# EAGLE design DRUM_1_CONTROL_8 (EAGLE 9.6.2)
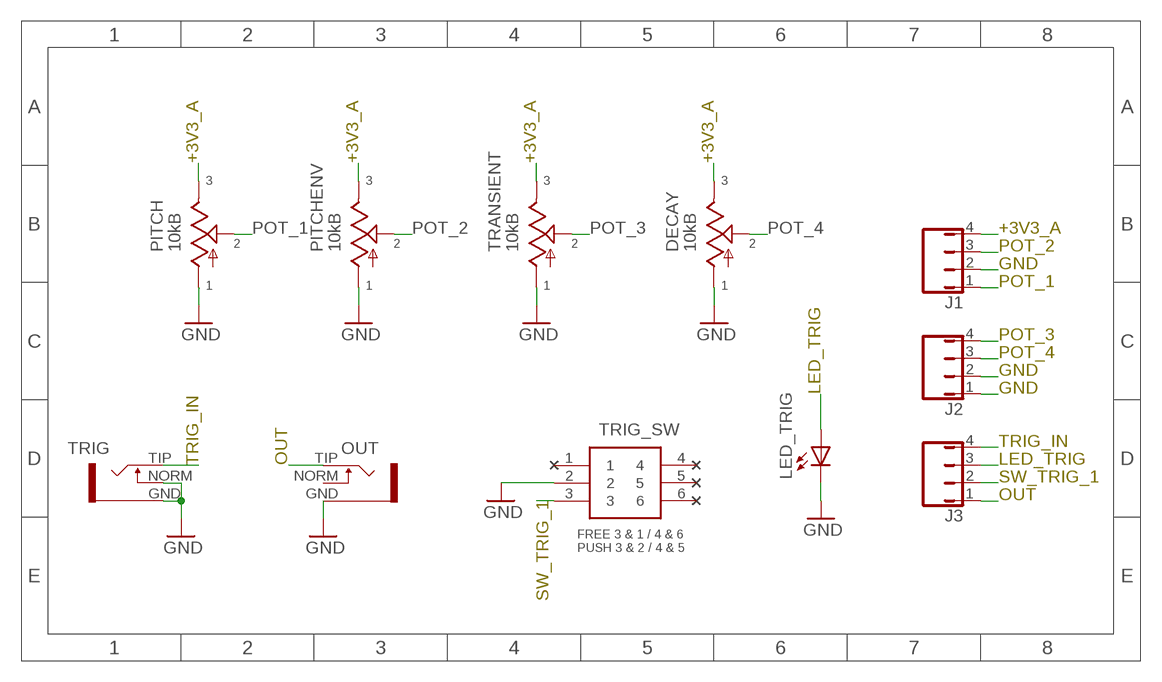
[diagram p0: schematic, sheet 1]

## Parts
DECAY  10kB  9MM_SNAP-IN_POT_  [9MM_SNAP-IN_POT]
J1  1x4 FEMALE HEADER  JMP/4P/SIP  [JMP/4P/SIP]
J2  1x4 FEMALE HEADER  JMP/4P/SIP  [JMP/4P/SIP]
J3  1x4 FEMALE HEADER  JMP/4P/SIP  [JMP/4P/SIP]
LED_TRIG  LEDS3MM  [LED3MM]
OUT  THONKICONN  [INSTRUO_S_JACK_SMALL2]
PITCH  10kB  9MM_SNAP-IN_POT_  [9MM_SNAP-IN_POT]
PITCHENV  10kB  9MM_SNAP-IN_POT_  [9MM_SNAP-IN_POT]
TRANSIENT  10kB  9MM_SNAP-IN_POT_  [9MM_SNAP-IN_POT]
TRIG  THONKICONN  [INSTRUO_S_JACK_SMALL2]
TRIG_SW  GPBS-800L 8MM MOMENTARY  GPBS-800L  [GPBS800L]

## Nets
+3V3_A [+3V3]: DECAY.3(E) J1.4 PITCH.3(E) PITCHENV.3(E) TRANSIENT.3(E)
GND [GND]: DECAY.1(A) J1.2 J2.1 J2.2 LED_TRIG.K(C) OUT.GND PITCH.1(A) PITCHENV.1(A) TRANSIENT.1(A) TRIG.GND TRIG.NORM TRIG_SW.2
LED_TRIG: J3.3 LED_TRIG.A
OUT: J3.1 OUT.TIP
POT_1: J1.1 PITCH.2(S)
POT_2: J1.3 PITCHENV.2(S)
POT_3: J2.4 TRANSIENT.2(S)
POT_4: DECAY.2(S) J2.3
SW_TRIG_1: J3.2 TRIG_SW.3
TRIG_IN: J3.4 TRIG.TIP
Unconnected: OUT.NORM TRIG_SW.1 TRIG_SW.4 TRIG_SW.5 TRIG_SW.6

## Notes on the sheet
- FREE 3 & 1 / 4 & 6
  PUSH 3 & 2 / 4 & 5

## Library data of the parts
DECAY PITCH PITCHENV TRANSIENT = AA_Stobbert_1:9MM_SNAP-IN_POT: POTENTIOMETER
J1-J3 = AA_Stobbert_1:JMP/4P/SIP
LED_TRIG = AA_Stobbert_1:LEDS
OUT TRIG = AA_Stobbert_1:THONKICONN: PJ301M-12
TRIG_SW = SamacSys_Parts:GPBS-800L: Pushbutton Switches DPDT Latching ON-ON Source: Datasheet <http://switches-connectors-custom.cwind.com/Asset/GPBS800LR1.pdf>; DESCRIPTION: Pushbutton Switches DPDT Latching ON-ON; HEIGHT: 13mm; MANUFACTURER_NAME: CW Industries; MANUFACTURER_PART_NUMBER: GPBS-800L; MOUSER_PART_NUMBER: 629-GPBS-800L; MOUSER_PRICE-STOCK: https://www.mouser.co.uk/ProductDetail/CW-Industries/GPBS-800L?qs=sajaCoHCXPRO4feefwykvw%3D%3D

## Net classes
0 default: width 0.254 mm
1 +3V3: width 0.305 mm
2 GND: width 0.254 mm

## Board
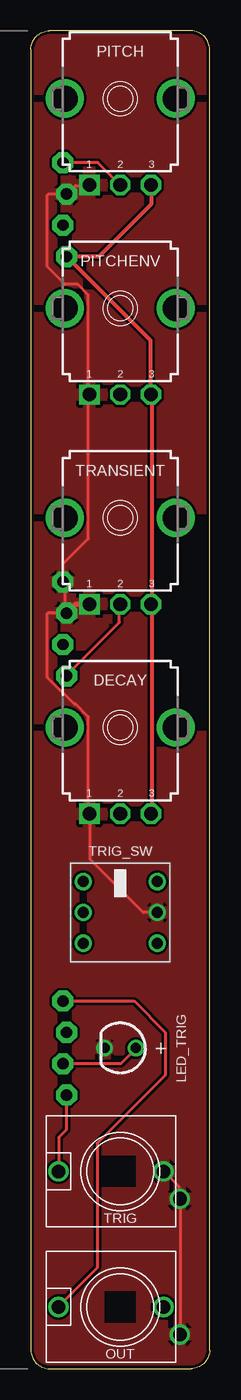
[diagram p1: board, top side]
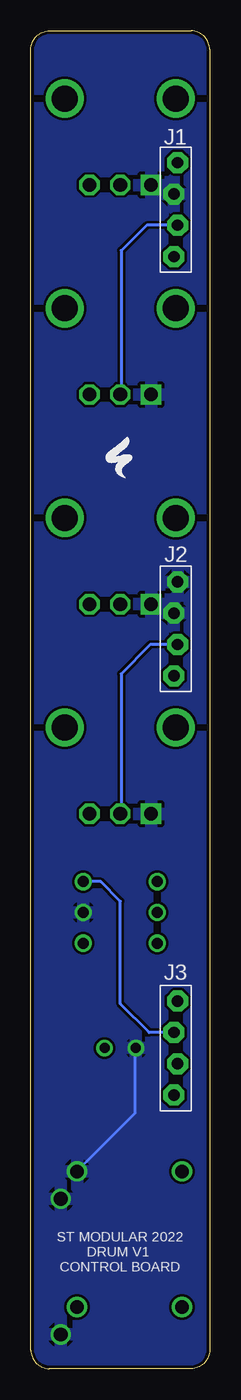
[diagram p2: board, bottom side, seen from below]

Size 14.5 x 108.5 mm. Coordinates in mm from the lower left corner, seen from the top.
Outline: 1.5,0 13,0 arc90 14.5,1.5 14.5,107 arc90 13,108.5 1.5,108.5 arc90 0,107 0,1.5 arc90 1.5,0
Copper layers (1*16): Top 0.035mm / dielectric 1.5mm / Bottom 0.035mm
Design rules "default *": minimum track width 6mil, minimum drill 0.3mm, track to track 8mil, track to pad 8mil, pad to pad 8mil, via to via 8mil, smd to smd 6mil, copper to edge 10mil, drill to drill 6mil, minimum pad ring 10mil, minimum via ring 8mil, stop-mask expansion 4mil, vias tented up to drill 15mil, thermal gap 10mil
Milling: area 3.8,113.9 to 7.1,117.1; area 7.5,113.9 to 10.7,117.1; area 3.8,-8.6 to 7.1,-5.4; area 7.5,-8.6 to 10.7,-5.4

### Footprints (pad centres in the part's own frame; a part is rotated, then mirrored left to right if it is on the bottom)
9MM_SNAP-IN_POT = drill 1.1 square: 1 -2.5,-7 | drill 1.1 octagon: 2 0,-7; 3 2.5,-7 | drill 2.1 pad 2.794: CHASSIS1 -4.5,0; CHASSIS2 4.5,0
JMP/4P/SIP = drill 0.914 pad 1.7 octagon: 1 -3.81,0.15; 2 -1.27,-0.15; 3 1.27,0.15; 4 3.81,-0.15
LED3MM = drill 0.813: A -1.27,0; K 1.27,0
INSTRUO_S_JACK_SMALL2 = drill 1.1: GND -2.223,-4.826; NORM 0,-3.5; TIP 0,5
GPBS800L = drill 0.9 pad 1.4: 1 -2.5,-3; 2 0,-3; 3 2.5,-3; 4 -2.5,3; 5 0,3; 6 2.5,3

### Placement (x,y rotation side)
DECAY  7.25,52 0 top
J1  2.75,94 270 bottom
J2  2.75,60 270 bottom
J3  2.75,26 270 bottom
LED_TRIG  7.25,26 180 top
OUT  7.25,5 90 top
PITCH  7.25,103 0 top
PITCHENV  7.25,86 0 top
TRANSIENT  7.25,69 0 top
TRIG  7.25,16 90 top
TRIG_SW  7.25,37 90 top

### Tracks (layer width: path | path; a pad name or v marks a point on that pad's centre or on a via)
+3V3_A
  Top 0.305: DECAY.3 9.81,45.09 9.81,61.89 TRANSIENT.3 9.81,62.12 9.81,78.92 PITCHENV.3 9.69,79.04 9.69,83.4 J1.4 5.5,90.19 9.75,94.44 PITCH.3
GND
  Top 0.254: PITCH.1 4.67,95.96 3.64,95.96 2.95,95.27 J1.2 1.43,95.27 1.35,95.19 1.35,89.36 2.75,87.95 3.79,87.95 4.67,87.08 4.67,79.04 PITCHENV.1 4.67,78.92 4.67,67.31 2.6,65.25 J2.1 2.61,63.72 2.75,63.58 2.75,61.55 2.96,61.34 2.95,61.32 J2.2 1.35,61.27 1.35,56.06 3.52,53.89 3.64,53.89 4.67,52.87 4.67,45.09 DECAY.1 4.78,44.98 4.78,41.34 9.12,37 TRIG_SW.2 | OUT.GND 12.09,2.8 12.09,13.77 TRIG.GND 11.98,13.89 11.98,14.8 10.84,15.95 TRIG.NORM
  Top 0.406: J2.2 3.63,62 TRANSIENT.1
  Bottom 0.254: LED_TRIG.K 6.04,25.89 6.04,20.75 10.72,16.06 TRIG.NORM
  pour Bottom: -2.25,111 -2.25,-2 16.75,-2 16.75,111
  pour Top: -3.25,112 -3.25,-3 17.75,-3 17.75,112
LED_TRIG
  Top 0.254: LED_TRIG.A 8.52,25.94 7.33,24.75 2.61,24.75 J3.3
OUT
  Top 0.254: OUT.TIP 2.21,5 5.38,8.17 5.38,18.28 10.89,23.79 10.89,27.29 8.37,29.81 J3.1
POT_1
  Top 0.254: J1.1 5.43,97.81 7.18,96.07 PITCH.2
POT_2
  Bottom 0.254: J1.3 5.12,92.73 7.18,90.67 7.18,79.04 PITCHENV.2
POT_3
  Top 0.254: TRANSIENT.2 7.18,61.89 7.18,60.52 2.95,56.29 J2.4
POT_4
  Bottom 0.254: J2.3 4.8,58.73 7.18,56.35 7.18,45.09 DECAY.2
SW_TRIG_1
  Bottom 0.254: J3.2 4.92,27.27 7.25,29.6 7.25,37.9 8.85,39.5 TRIG_SW.3
TRIG_IN
  Top 0.254: TRIG.TIP 2.27,16.06 2.27,18.77 2.9,19.4 J3.4

### Text on the board
bPlace: ST MODULAR 2022 / DRUM V1 / CONTROL BOARD